# Altium schematic sheet Control Logic.SchDoc
size B; Author: E. Sims; Organization: Let's Build Rockets Inc.; SheetNumber: 8; SheetTotal: 11
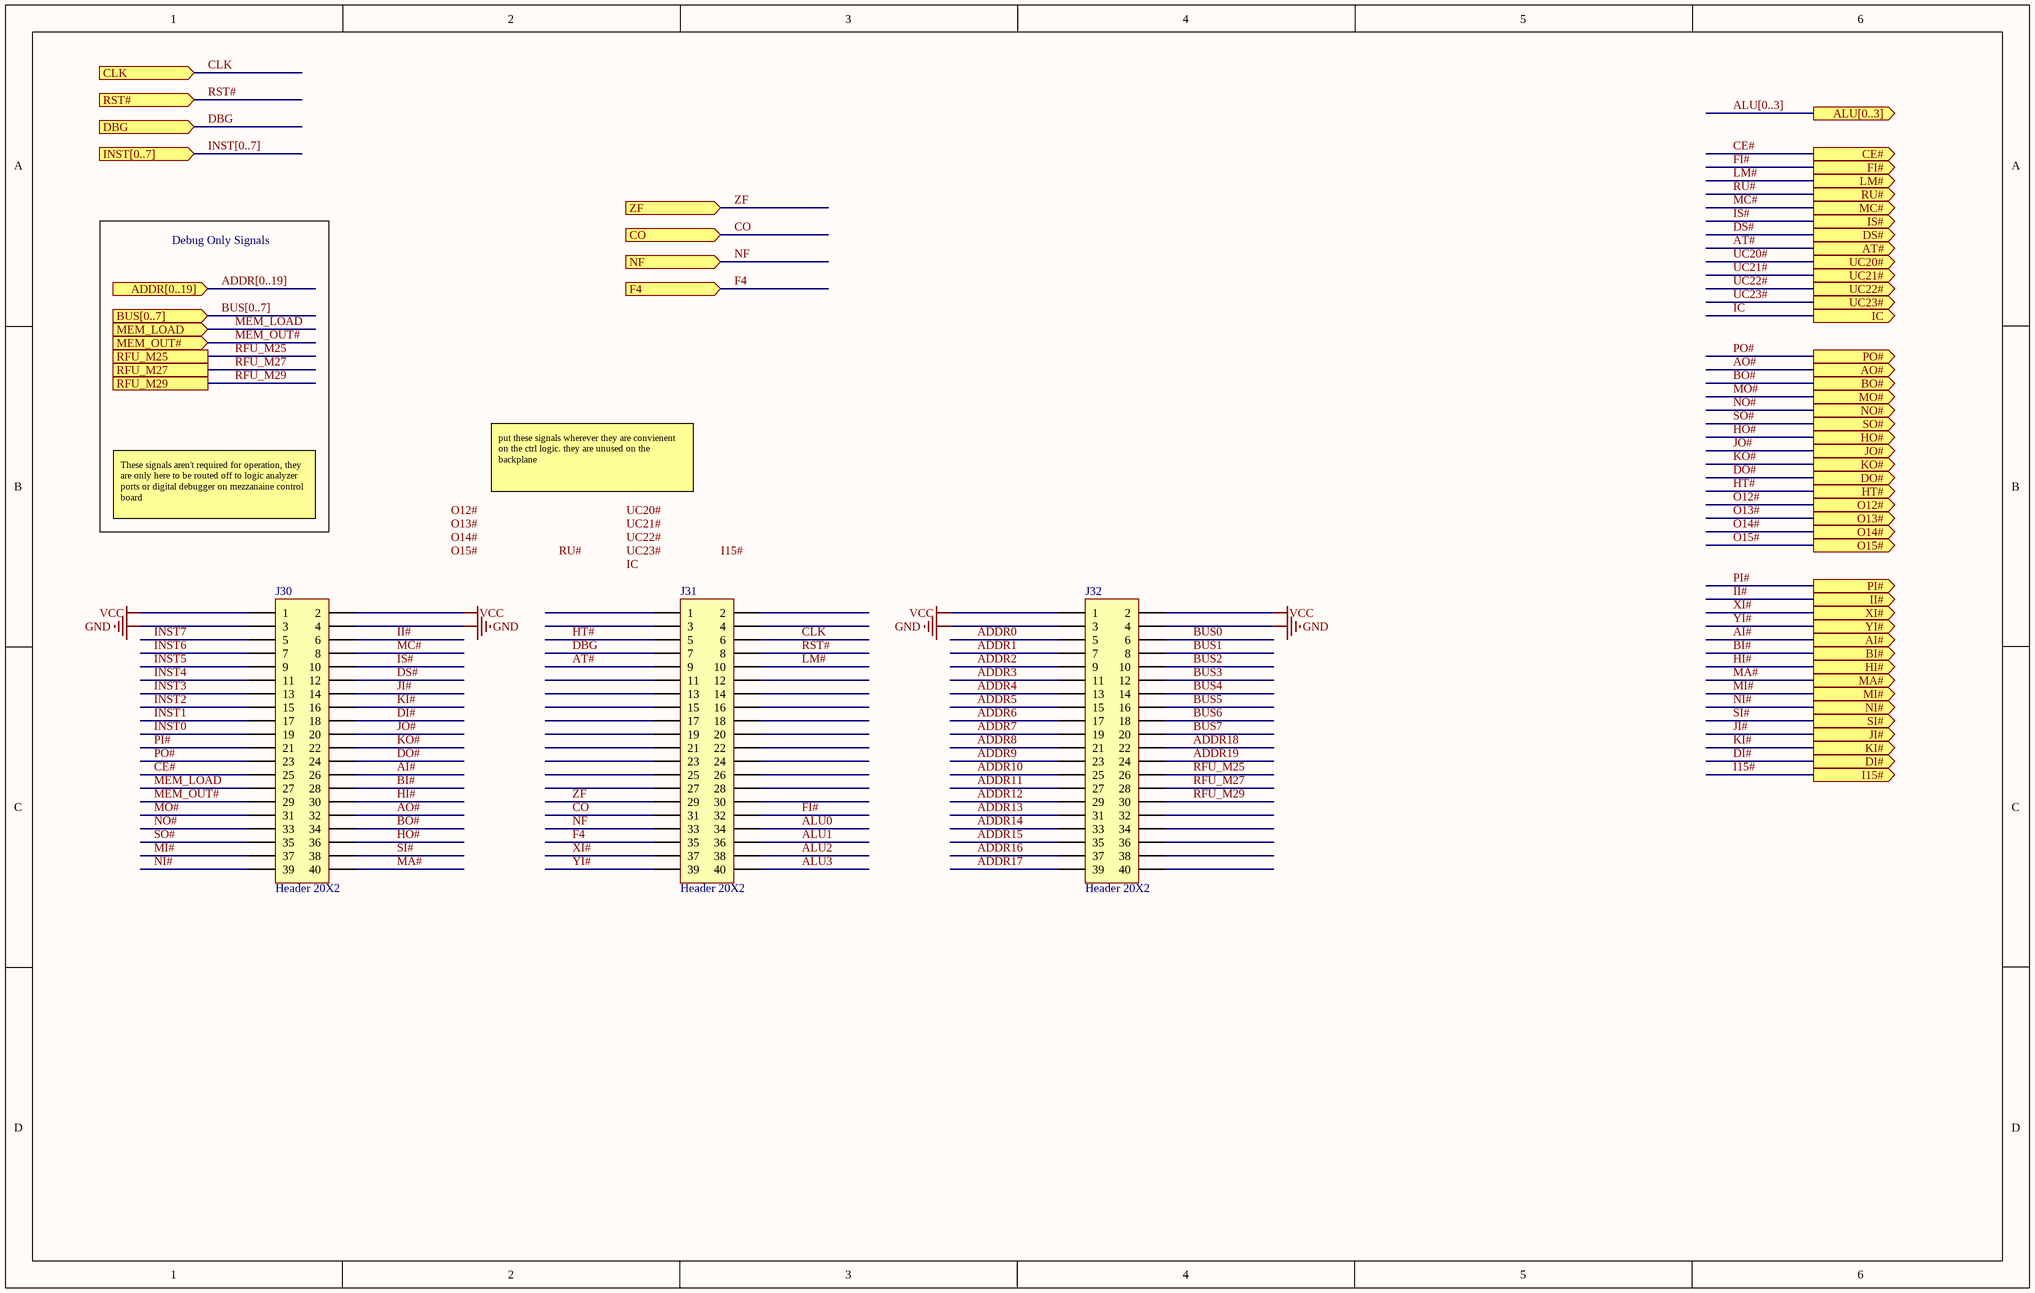
[diagram p0: Control Logic.SchDoc]

## Parts
J30  Header 20X2  [HDR2X20]
J31  Header 20X2  [HDR2X20]
J32  Header 20X2  [HDR2X20]

## Ports
ADDR[0..19] (in), AI# (out), ALU[0..3] (out), AO# (out), AT# (out), BI# (out), BO# (out), BUS[0..7] (in), CE# (out), CLK (in), CO (in), DBG (in), DI# (out), DO# (out), DS# (out), F4 (in), FI# (out), HI# (out), HO# (out), HT# (out), I15# (out), IC (out), II# (out), INST[0..7] (in), IS# (out), JI# (out), JO# (out), KI# (out), KO# (out), LM# (out), MA# (out), MC# (out), MEM_LOAD (in), MEM_OUT# (in), MI# (out), MO# (out), NF (in), NI# (out), NO# (out), O12# (out), O13# (out), O14# (out), O15# (out), PI# (out), PO# (out), RFU_M25, RFU_M27, RFU_M29, RST# (in), RU# (out), SI# (out), SO# (out), UC20# (out), UC21# (out), UC22# (out), UC23# (out), XI# (out), YI# (out), ZF (in)

## Nets
GND: J30.3 J30.4 J32.3 J32.4
VCC: J30.1 J30.2 J32.1 J32.2
ADDR0: J32.5
ADDR1: J32.7
ADDR2: J32.9
ADDR3: J32.11
ADDR4: J32.13
ADDR5: J32.15
ADDR6: J32.17
ADDR7: J32.19
ADDR8: J32.21
ADDR9: J32.23
ADDR10: J32.25
ADDR11: J32.27
ADDR12: J32.29
ADDR13: J32.31
ADDR14: J32.33
ADDR15: J32.35
ADDR16: J32.37
ADDR17: J32.39
ADDR18: J32.22
ADDR19: J32.24
AI#: J30.26 ; port AI#
ALU0: J31.34
ALU1: J31.36
ALU2: J31.38
ALU3: J31.40
AO#: J30.32 ; port AO#
AT#: J31.9 ; port AT#
BI#: J30.28 ; port BI#
BO#: J30.34 ; port BO#
BUS0: J32.6
BUS1: J32.8
BUS2: J32.10
BUS3: J32.12
BUS4: J32.14
BUS5: J32.16
BUS6: J32.18
BUS7: J32.20
CE#: J30.25 ; port CE#
CLK: J31.6 ; port CLK
CO: J31.31 ; port CO
DBG: J31.7 ; port DBG
DI#: J30.18 ; port DI#
DO#: J30.24 ; port DO#
DS#: J30.12 ; port DS#
F4: J31.35 ; port F4
FI#: J31.32 ; port FI#
HI#: J30.30 ; port HI#
HO#: J30.36 ; port HO#
HT#: J31.5 ; port HT#
I15#: port I15#
IC: port IC
II#: J30.6 ; port II#
INST0: J30.19
INST1: J30.17
INST2: J30.15
INST3: J30.13
INST4: J30.11
INST5: J30.9
INST6: J30.7
INST7: J30.5
IS#: J30.10 ; port IS#
JI#: J30.14 ; port JI#
JO#: J30.20 ; port JO#
KI#: J30.16 ; port KI#
KO#: J30.22 ; port KO#
LM#: J31.10 ; port LM#
MA#: J30.40 ; port MA#
MC#: J30.8 ; port MC#
MEM_LOAD: J30.27 ; port MEM_LOAD
MEM_OUT#: J30.29 ; port MEM_OUT#
MI#: J30.37 ; port MI#
MO#: J30.31 ; port MO#
NF: J31.33 ; port NF
NI#: J30.39 ; port NI#
NO#: J30.33 ; port NO#
O12#: port O12#
O13#: port O13#
O14#: port O14#
O15#: port O15#
PI#: J30.21 ; port PI#
PO#: J30.23 ; port PO#
RFU_M25: J32.26 ; port RFU_M25
RFU_M27: J32.28 ; port RFU_M27
RFU_M29: J32.30 ; port RFU_M29
RST#: J31.8 ; port RST#
RU#: port RU#
SI#: J30.38 ; port SI#
SO#: J30.35 ; port SO#
UC20#: port UC20#
UC21#: port UC21#
UC22#: port UC22#
UC23#: port UC23#
XI#: J31.37 ; port XI#
YI#: J31.39 ; port YI#
ZF: J31.29 ; port ZF

Not connected (* = marked no-connect by the designer): J31 1 2 3 4 11 12 13 14 15 16 17 18 19 20 21 22 23 24 25 26 27 28 30; J32 32 34 36 38 40

## Buses and harness runs
bus ADDR[0..19] = port ADDR[0..19]
bus ALU[0..3] = port ALU[0..3]
bus BUS[0..7] = port BUS[0..7]
bus INST[0..7] = port INST[0..7]

## Notes on the sheet
- Debug Only Signals
- put these signals wherever they are convienent on the ctrl logic. they are unused on the backplane
- These signals aren't required for operation, they are only here to be routed off to logic analyzer ports or digital debugger on mezzanaine control board
- Labels drawn without touching a wire or pin: I15#, IC, O12#, O13#, O14#, O15#, RU#, UC20#, UC21#, UC22#, UC23#
- Let's Build Rocket's Inc. Modular Paylaod System Based on TMP-010 Rev
  For more information visit https://github.com/LetsBuildRockets/Modular-Payload-System
  This work is licensed under CC BY-NC 4.0. To view a copy of this license, visit https://creativecommons.org/licenses/by-nc/4.0
- Title
- Size:
- Date:
- Assembly Variant:
- B
- Number:
- Time:
- Revision:
- Sheet
- of
- Author:
- File:

## Library data of the parts
J30-J32 = Header 20X2: Header, 20-Pin, Dual row; System: Connector; LatestRevisionDate: 17-Jul-2002; LatestRevisionNote: Re-released for DXP Platform.; Publisher: Altium Limited